# Altium schematic sheet power_supply.SchDoc
size OrCAD A; DrawnBy: Van Tuan Ngo; Organization: PIF Club; Address1: HCMUT,; Address2: Ly Thuong Kiet St.,; Address3: District 10, HCM, VN; DocumentNumber: 2; Revision: 1.0.0; SheetNumber: 2; SheetTotal: 4; Project: RTLS
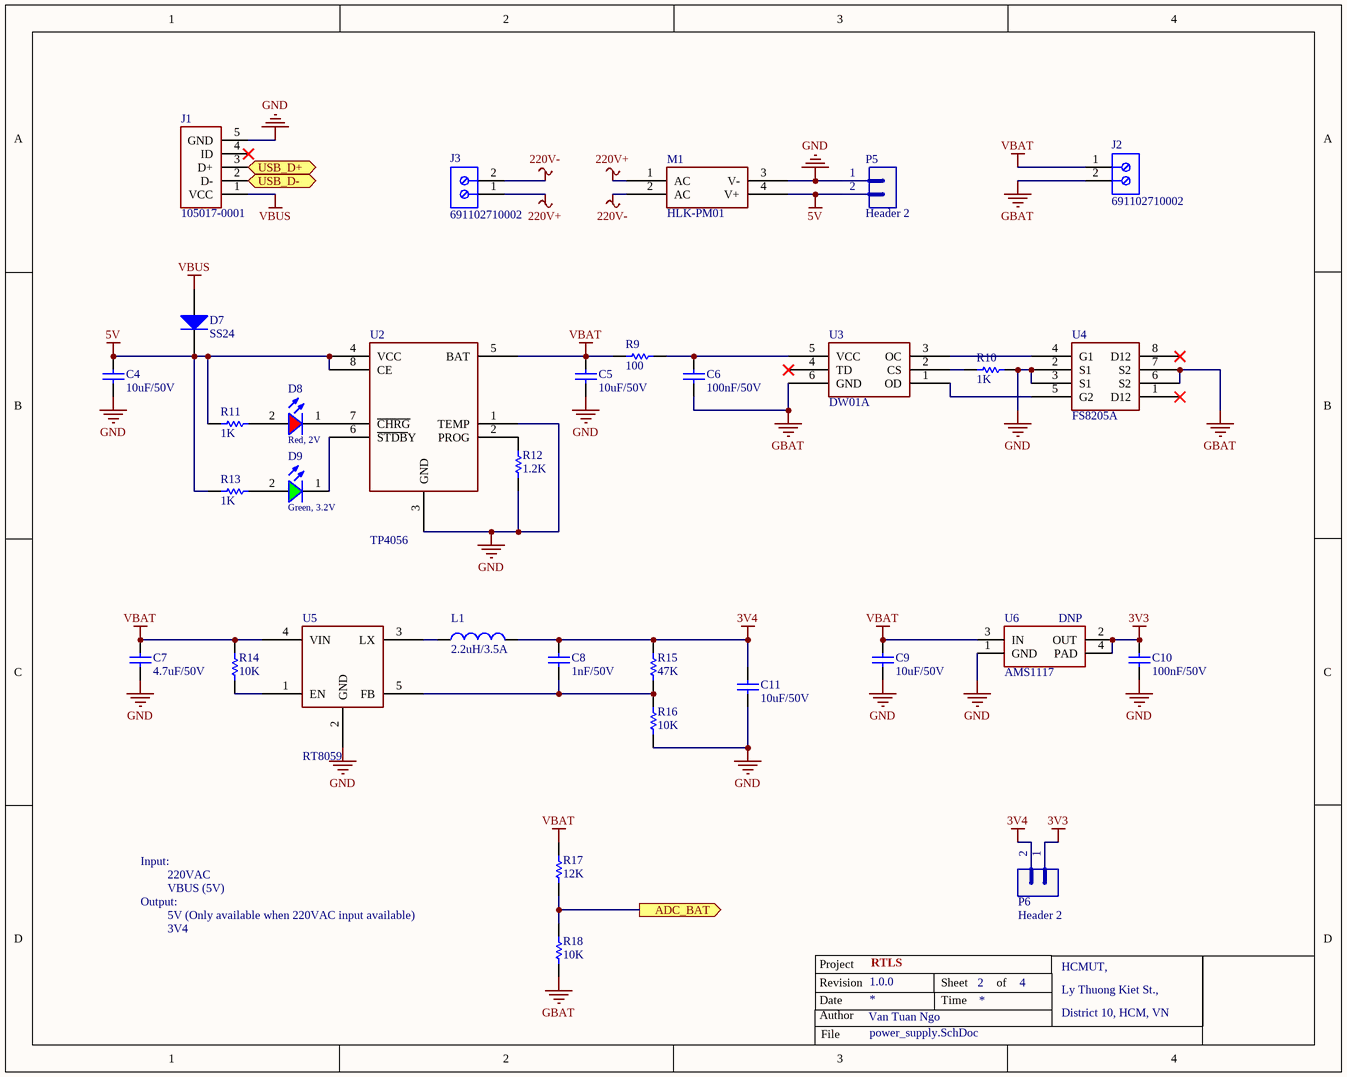
[diagram p0: power_supply.SchDoc]

## Parts
C4  value 10uF/50V  [CAP-SM-0805]  (hidden comment: Cap-10uF-50V-0805)
C5  value 10uF/50V  [CAP-SM-0805]  (hidden comment: Cap-10uF-50V-0805)
C6  value 100nF/50V  [CAP-SM-0805]  (hidden comment: Cap-100nF-50V-0805)
C7  value 4.7uF/50V  [CAP-SM-0805]  (hidden comment: Cap-4.7uF-50V-0805)
C8  value 1nF/50V  [CAP-SM-0805]  (hidden comment: Cap-22pF-50V-0805)
C9  value 10uF/50V  [CAP-SM-0805]  (hidden comment: Cap-10uF-50V-0805)
C10  value 100nF/50V  [CAP-SM-0805]  (hidden comment: Cap-100nF-50V-0805)
C11  value 10uF/50V  [CAP-SM-0805]  (hidden comment: Cap-10uF-50V-0805)
D7  SS24  [SS24]
D8  Red, 2V  [WL-SMCW_0805]
D9  Green, 3.2V  [WL-SMCW_0805]
J1  105017-0001  [Micro-USB-Female]
J2  691102710002  [691102710002]
J3  691102710002  [691102710002]
L1  2.2uH/3.5A  [CD53]
M1  HLK-PM01  [HLK-PM01]
P5  Header 2  [JP2]
P6  Header 2  [JP2]
R9  value 100  [RES-SM-0805]  (hidden comment: Res-100-0805)
R10  value 1K  [RES-SM-0805]  (hidden comment: Res-1K-0805)
R11  value 1K  [RES-SM-0805]  (hidden comment: Res-1K-0805)
R12  value 1.2K  [RES-SM-0805]  (hidden comment: Res-1.2K-0805)
R13  value 1K  [RES-SM-0805]  (hidden comment: Res-1K-0805)
R14  value 10K  [RES-SM-0805]  (hidden comment: Res-10k-0805)
R15  value 47K  [RES-SM-0805]  (hidden comment: Res-47K-0805)
R16  value 10K  [RES-SM-0805]  (hidden comment: Res-10k-0805)
R17  value 12K  [RES-SM-0805]  (hidden comment: Res-12K-0805)
R18  value 10K  [RES-SM-0805]  (hidden comment: Res-10k-0805)
U2  TP4056  [SOP8]
U3  DW01A  [SOT-23-6]
U4  FS8205A  [TSSOP8]
U5  RT8059  [SOT-23-5]
U6  AMS1117  [SOT223]

## Ports
ADC_BAT (out), USB_D+ (bidir), USB_D- (bidir)

## Nets
3V3: C10.2 P6.1 U6.2(OUT) U6.4(PAD)
3V4: C8.2 C11.2 L1.2 P6.2 R15.2
5V: C4.2 D7.1(K) M1.4(V+) P5.2 R11.1 R13.1 U2.4(VCC) U2.8(CE)
220V+: J3.1 M1.1(AC)
220V-: J3.2 M1.2(AC)
GBAT: C6.1 J2.2 R18.1 U3.6(GND) U4.6(S2) U4.7(S2)
GND: C4.1 C5.1 C7.1 C9.1 C10.1 C11.1 J1.5(GND) M1.3(V-) P5.1 R10.2 R12.1 R16.1 U2.1(TEMP) U2.3(GND) U4.2(S1) U4.3(S1) U5.2(GND) U6.1(GND)
VBAT: C5.2 C7.2 C9.2 J2.1 R9.1 R14.2 R17.2 U2.5(BAT) U5.4(VIN) U6.3(IN)
VBUS: D7.2(A) J1.1(VCC)
ADC_BAT: R17.1 R18.2 ; port ADC_BAT
USB_D+: J1.3(D+) ; port USB_D+
USB_D-: J1.2(D-) ; port USB_D-
NetC6_2: C6.2 R9.2 U3.5(VCC)
NetC8_1: C8.1 R15.1 R16.2 U5.5(FB)
NetD8_1: D8.1(K) U2.7(~{CHRG})
NetD8_2: D8.2(A) R11.2
NetD9_1: D9.1(K) U2.6(~{STDB}Y)
NetD9_2: D9.2(A) R13.2
NetL1_1: L1.1 U5.3(LX)
NetR10_1: R10.1 U3.2(CS)
NetR12_2: R12.2 U2.2(PROG)
NetR14_1: R14.1 U5.1(EN)
NetU3_1: U3.1(OD) U4.5(G2)
NetU3_3: U3.3(OC) U4.4(G1)

Not connected (* = marked no-connect by the designer): J1 4(ID)*; U3 4(TD)*; U4 1(D12)* 8(D12)*

## Notes on the sheet
- (near U6) DNP
- Input:
- 220VAC
- VBUS (5V)
- Output:
- 3V4
- 5V (Only available when 220VAC input available)
- Project
- Revision
- Date
- Author
- Sheet
- Time
- of
- File

## Library data of the parts
C4 C5 C9 C11 = Cap-10uF-50V-0805: CAP CER 10UF 50V X5R 0805; Manufacturer: Yageo; Manufacturer Part Number: CC0805KKX5R9BB106; Local Supplier: thegioiic; Local Supplier Link: https://www.thegioiic.com/products/tu-gom-0805-10uf-50v; Supplier 1: Digikey; Supplier 1 Link: https://www.digikey.com/product-detail/en/yageo/CC0805KKX5R9BB106/311-3499-2-ND/7164383; Supplier 1 Part Number: 311-3499-2-ND
C6 C10 = Cap-100nF-50V-0805: CAP CER 0.1UF 50V Y5V 0805; Manufacturer: Samsung Electro-Mechanics; Manufacturer Part Number: CL21F104ZBCNNNC; Local Supplier: thegioiic; Local Supplier Link: https://www.thegioiic.com/products/tu-gom-0805-100nf-0-1uf-50v; Supplier 1: Digikey; Supplier 1 Part Number: 1276-1007-1-ND; Supplier 1 Link: https://www.digikey.com/product-detail/en/samsung-electro-mechanics/CL21F104ZBCNNNC/1276-1007-1-ND/3889093
C7 = Cap-4.7uF-50V-0805: CAP CER 4.7UF 50V X5R 0805; Manufacturer: Murata Electronics; Manufacturer Part Number: GRM21BR61H475KE51L; Local Supplier: thegioiic; Local Supplier Link: https://thegioiic.com/products/tu-4-7uf-50v-0805-cap; Supplier 1: Digikey; Supplier 1 Link: https://www.digikey.com/product-detail/en/murata-electronics/GRM21BR61H475KE51L/490-10751-1-ND/5251349; Supplier 1 Part Number: 490-10751-1-ND
C8 = Cap-22pF-50V-0805: CAP CER 22PF 100V X7R 0805; Manufacturer: Johanson Dielectrics Inc.; Manufacturer Part Number: 101X15W102MV4E; Local Supplier: thegioiic; Local Supplier Link: https://thegioiic.com/products/tu-1nf-50v-0805; Supplier 1: Digikey; Supplier 1 Link: https://www.digikey.com/product-detail/en/johanson-dielectrics-inc/101X15W102MV4E/709-1335-1-ND/2327235; Supplier 1 Part Number: 709-1335-1-ND
D7 = Diode-SS24: DIODE SCHOTTKY 40V 2A DO214AA; Manufacturer: ON Semiconductor; Local Supplier: thegioiic; Local Supplier Link: https://thegioiic.com/products/ss24-smb; Supplier 1: Digikey; Supplier 1 Part Number: SS24FSCT-ND; Manufacturer Part Number: SS24; Supplier 1 Link: https://www.digikey.com/product-detail/en/on-semiconductor/SS24/SS24FSCT-ND/1626273
D8 = 150080RS75000: WL-SMCW SMT Mono-color Chip LED Waterclear, size 0805, Red, 2V, 140deg; Chip Technology: AlInGaP; Dominant Wavelength typ.: 625nm; Luminous Intensity typ.: 150mcd; Peak Wavelength typ.: 630nm; Viewing Angle: 140deg; ComponentLink1Description: Manufacturer; ComponentLink1URL: http://www.we-online.de; ComponentLink2URL: https://www.we-online.com/catalog/datasheet/150080RS75000.pdf; ComponentLink2Description: Datasheet; Forward Voltage typ.: 2V; Emitting Color: Red; Mounting Technology: SMT; Operating Temperature: -40 to +85degC; Published Date: December 2019; Part Number: 150080RS75000; Packaging: Tape and Reel; Size: 0805; Publisher: Wurth Elektronik
D9 = 150080GS75000: WL-SMCW SMT Mono-color Chip LED Waterclear, size 0805, Green, 3.2V, 140deg; Chip Technology: InGaN; Dominant Wavelength typ.: 525nm; Luminous Intensity typ.: 450mcd; Peak Wavelength typ.: 515nm; Viewing Angle: 140deg; ComponentLink1Description: Manufacturer; ComponentLink1URL: http://www.we-online.de; ComponentLink2URL: https://www.we-online.com/catalog/datasheet/150080GS75000.pdf; ComponentLink2Description: Datasheet; Forward Voltage typ.: 3.2V; Emitting Color: Green; Mounting Technology: SMT; Operating Temperature: -40 to +85degC; Published Date: December 2019; Part Number: 150080GS75000; Packaging: Tape and Reel; Size: 0805; Publisher: Wurth Elektronik
J1 = Micro-USB-Female: CONN RCPT USB2.0 MICRO B SMD R/A; Vendor: Molex Connector Corporation; Built_By: EMA_Cory; SourceLibrary: Molex_2020-05-26; Datasheet: https://www.molex.com/pdm_docs/sd/1050170001_sd.pdf; Manufacturer_Part_Number: 105017-0001; Copyright: Copyright (C) 2018 Accelerated Designs. All rights reserved; RefDes: RefDes; Type: DEV; Local Supplier: thegioiic; Local Supplier Part Number: x; Local Supplier Link: https://www.thegioiic.com/products/cong-usb-micro-b-2-0-dau-cai-5-chan-smd-v1
J2 J3 = 691102710002: WR-TBL Serie 102 Horizontal Entry Modular, Pressure Clamp, pitch 5mm, 2p; Compliance: Lead free / RoHS; Modularity: Yes; PCB/Cable/Panel: PCB; Pin Number: 2; Rated Current [UL]: 15A; Working Voltage [UL]: 250VAC; ComponentLink1Description: Manufacturer; ComponentLink1URL: http://www.we-online.de; ComponentLink2URL: https://katalog.we-online.de/em/datasheet/691102710002.pdf; ComponentLink2Description: Datasheet; Mounting Technology: THT; Part Number: 691102710002; Packaging: Box; Operating Temperature: -40 to +105degC; Pitch: 5mm; Published Date: October 2019; Type: Horizontal; Publisher: Wurth Elektronik; Application: Pressure Clamp
L1 = ind-2.2uH-3.5A-CD53
P5 P6 = Header 2: Header, 2-Pin; LatestRevisionDate: 17-Jul-2002; LatestRevisionNote: Re-released for DXP Platform.; Publisher: Altium Limited; Local Supplier: thegioiic; Local Supplier Part Number: x; Local Supplier Link: https://www.thegioiic.com/products/hang-rao-duc-don-2-54mm-40-chan-1-hang-cao-11-4mm-xuyen-lo
R9 = Res-100-0805: RES 100 OHM 0.1% 1/5W 0805; Manufacturer: Vishay Thin Film; Manufacturer Part Number: PTN0805E10R0BST1; Local Supplier: thegioiic; Local Supplier Link: https://thegioiic.com/products/dien-tro-10-ohm-0805-5; Supplier 1: Digikey; Supplier 1 Link: https://www.digikey.com/product-detail/en/vishay-thin-film/PTN0805E10R0BST1/764-1471-1-ND/7103255; Supplier 1 Part Number: 764-1471-1-ND
R10 R11 R13 = Res-1K-0805: RES 1K OHM 1% 1/4W 0805; Manufacturer: Stackpole Electronics Inc; Manufacturer Part Number: RNCP0805FTD1K00; Local Supplier: thegioiic; Local Supplier Link: https://www.thegioiic.com/products/dien-tro-1-kohm-0805-5; Supplier 1: Digikey; Supplier 1 Link: https://www.digikey.com/product-detail/en/stackpole-electronics-inc/RNCP0805FTD1K00/RNCP0805FTD1K00CT-ND/2240568; Supplier 1 Part Number: RNCP0805FTD1K00CT-ND
R12 = Res-1.2K-0805: RES SMD 1.2K OHM 1% 1/8W 0805; Manufacturer: TE Connectivity Passive Product; Manufacturer Part Number: CRG0805F1K2; Local Supplier: thegioiic; Local Supplier Link: https://thegioiic.com/products/dien-tro-1-2k-ohm-0805-5; Supplier 1: Digikey; Supplier 1 Link: https://www.digikey.com/product-detail/en/te-connectivity-passive-product/CRG0805F1K2/A126346CT-ND/7603401; Supplier 1 Part Number: A126346CT-ND
R14 R16 R18 = Res-10k-0805: RES 10K OHM 1% 1/4W 0805; Manufacturer: Stackpole Electronics Inc; Manufacturer Part Number: RNCP0805FTD10K0; Local Supplier: thegioiic; Local Supplier Link: https://www.thegioiic.com/products/dien-tro-10-kohm-0805-5; Supplier 1: Digikey; Supplier 1 Link: https://www.digikey.com/product-detail/en/stackpole-electronics-inc/RNCP0805FTD10K0/RNCP0805FTD10K0CT-ND/2240601; Supplier 1 Part Number: RNCP0805FTD10K0CT-ND
R15 = Res-47K-0805: RES SMD 47K OHM 1% 1/8W 0805; Manufacturer: Yageo; Manufacturer Part Number: RC0805FR-0747KL; Local Supplier: thegioiic; Local Supplier Link: https://thegioiic.com/products/dien-tro-47k-ohm-0603-5; Supplier 1: Digikey; Supplier 1 Part Number: 311-47.0KCRCT-ND; Supplier 1 Link: https://www.digikey.com/product-detail/en/yageo/RC0805FR-0747KL/311-47.0KCRCT-ND/730920
R17 = Res-12K-0805: RES 12 KOHM JUMPER 0805; Manufacturer: Vishay Thin Film; Manufacturer Part Number: PAT0805E3121BST1; Local Supplier: icdayroi; Local Supplier Link: https://icdayroi.com/dien-tro-12k-0805-1-goi-50-con; Supplier 1: Digikey; Supplier 1 Link: https://www.digikey.com/product-detail/en/vishay-thin-film/PAT0805E3121BST1/PAT0805E3121BST1-ND/2281536; Supplier 1 Part Number: PAT0805E3121BST1-ND
U2 = TP4056: Linear charger for single cell / lithium-ion batteries
U3 = DW01A: Battery protection IC
U5 = RT8059: High efficiency PWM step-down DC/DC converter
U6 = AMS1117: Available in 1.8V, 2.5V, 2.85V, 3.3V, 5V, and  Adjustable Versions; Local Supplier: thegioiic; Local Supplier Part Number: *; Local Supplier Link: https://www.thegioiic.com/products/ams1117-3-3v